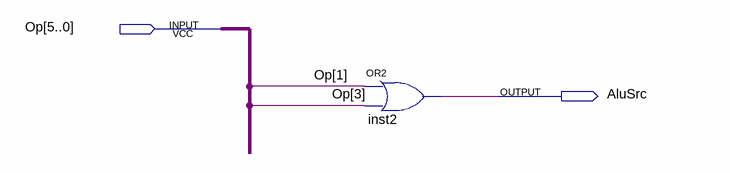
[diagram p0: schematic sheet]
// Quartus schematic AluSrcDecoder.bdf as structural Verilog: 1 symbols, 2 pins
module AluSrcDecoder (
  input  [5:0] Op,
  output AluSrc
);

  or inst2 (AluSrc, Op[1], Op[3]);
endmodule
